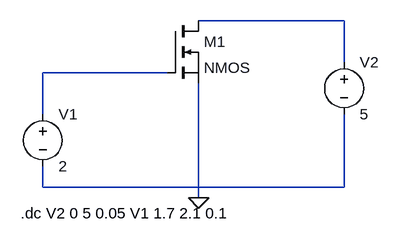
[diagram p0: schematic Draft6.asc]
Draft6.asc, the LTspice schematic file:
Version 4
SHEET 1 880 680
WIRE 496 144 272 144
WIRE 496 208 496 144
WIRE 224 224 32 224
WIRE 32 288 32 224
WIRE 32 400 32 368
WIRE 496 400 496 288
WIRE 496 400 32 400
WIRE 272 416 272 240
FLAG 272 416 0
SYMBOL voltage 32 272 R0
SYMATTR InstName V1
SYMATTR Value 2
SYMBOL voltage 496 192 R0
SYMATTR InstName V2
SYMATTR Value 5
SYMBOL nmos 224 144 R0
SYMATTR InstName M1
TEXT -2 440 Left 2 !.dc V2 0 5 0.05 V1 1.7 2.1 0.1

The netlist it stands for:
* Draft6.asc
V1 N002 N003 2
V2 N001 N003 5
M1 N001 N002 0 0 NMOS
.model NMOS NMOS
.model PMOS PMOS
.lib standard.mos
.dc V2 0 5 0.05 V1 1.7 2.1 0.1
.backanno
.end